# Altium schematic sheet Input - Output.SchDoc
size A4; SheetNumber: 4; SheetTotal: 7
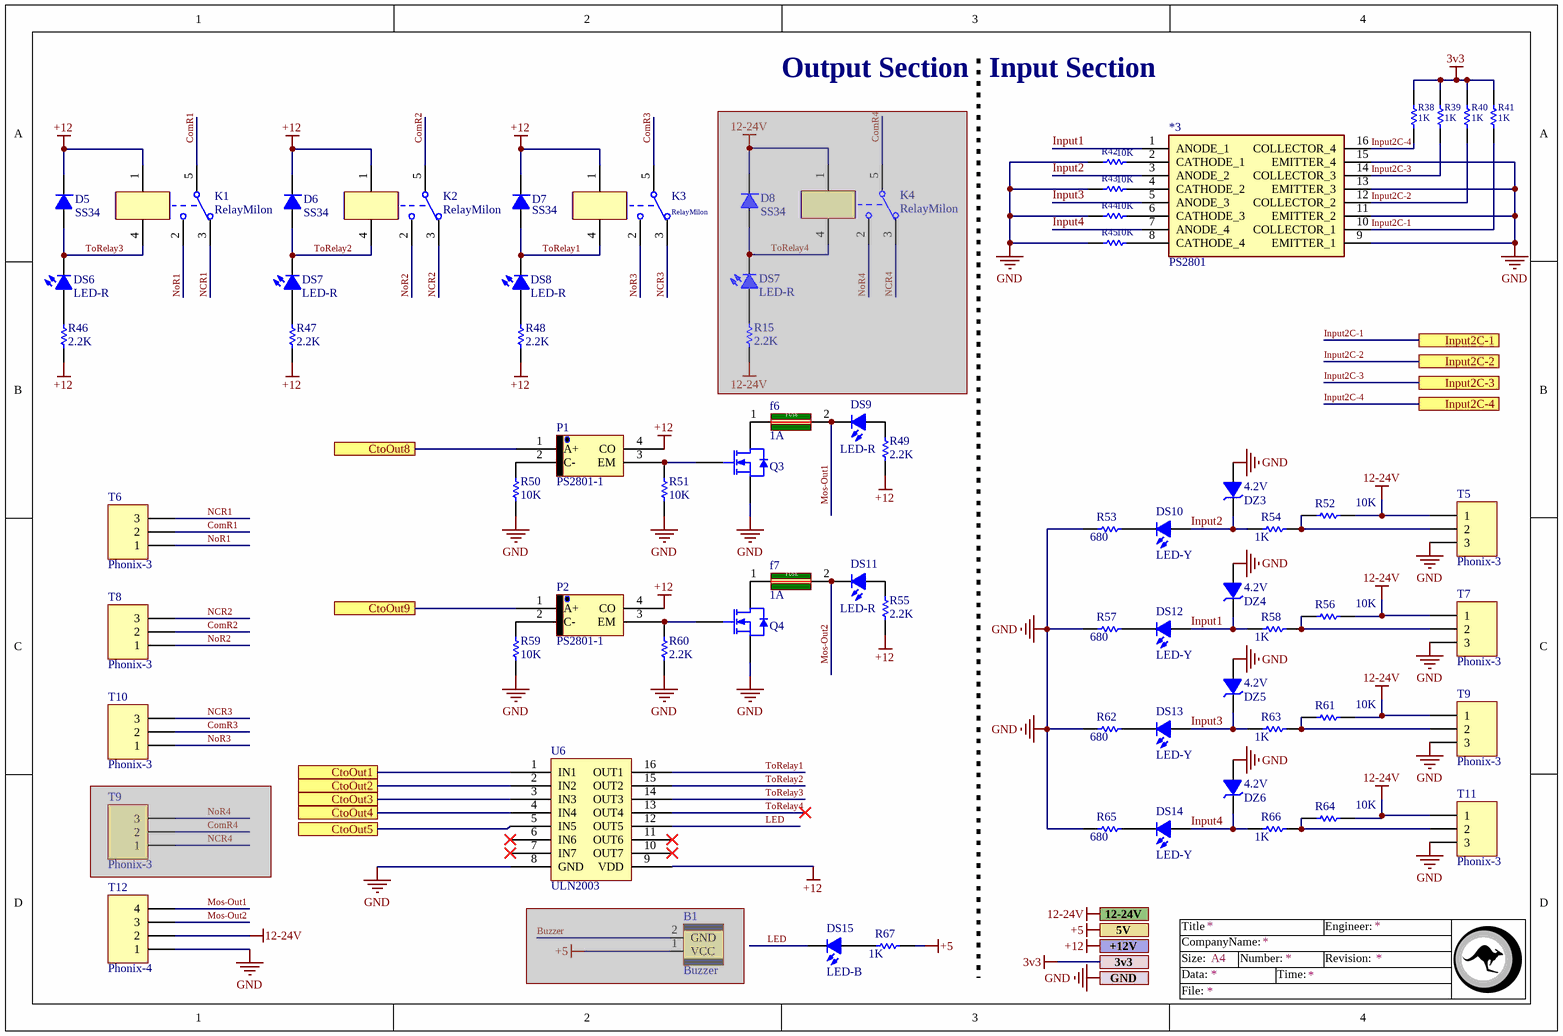
[diagram p0: Input - Output.SchDoc]

## Parts
(Parts that share a designator on the sheet are numbered #1, #2 ... from top to bottom, then left to right.)
*3  PS2801  [PS2801]
B1  Buzzer  [Buzzer]  (masked out: inside a compile mask, not in the netlist)
D5  SS34  [Diod-1A-SMD]
D6  SS34  [Diod-1A-SMD]
D7  SS34  [Diod-1A-SMD]
D8  SS34  [Diod-1A-SMD]  (masked out: inside a compile mask, not in the netlist)
DS6  LED-R  [Led0805]
DS7#1  LED-R  [Led0805]
DS7#2  LED-R  [Led0805]  (masked out: inside a compile mask, not in the netlist)
DS8  LED-R  [Led0805]
DS9  LED-R  [Led0805]
DS10  LED-Y  [Led0805]
DS11  LED-R  [Led0805]
DS12  LED-Y  [Led0805]
DS13  LED-Y  [Led0805]
DS14  LED-Y  [Led0805]
DS15  LED-B  [LED - DipS]
DZ3  4.2V  [LL4148]
DZ4  4.2V  [LL4148]
DZ5  4.2V  [LL4148]
DZ6  4.2V  [LL4148]
f6  1A  [1206]
f7  1A  [1206]
K1  RelayMilon  [Relay_MILONBIG]
K2  RelayMilon  [Relay_MILONBIG]
K3  RelayMilon  [Relay_MILONBIG]
K4  RelayMilon  [Relay_MILONBIG]  (masked out: inside a compile mask, not in the netlist)
P1  PS2801-1  [PS2801-1]
P2  PS2801-1  [PS2801-1]
Q3  MOSFET-N  [TO252-S]  (value not drawn)
Q4  MOSFET-N  [TO252-S]  (value not drawn)
R15  2.2K  [R0805]  (masked out: inside a compile mask, not in the netlist)
R38  1K  [R0805]
R39  1K  [R0805]
R40  1K  [R0805]
R41  1K  [R0805]
R42  10K  [R0805]
R43  10K  [R0805]
R44  10K  [R0805]
R45  10K  [R0805]
R46  2.2K  [R0805]
R47  2.2K  [R0805]
R48  2.2K  [R0805]
R49  2.2K  [R0805]
R50  10K  [R0805]
R51  10K  [R0805]
R52  10K  [R0805]
R53  680  [R0805]
R54  1K  [R0805]
R55  2.2K  [R0805]
R56  10K  [R0805]
R57  680  [R0805]
R58  1K  [R0805]
R59  10K  [R0805]
R60  2.2K  [R0805]
R61  10K  [R0805]
R62  680  [R0805]
R63  1K  [R0805]
R64  10K  [R0805]
R65  680  [R0805]
R66  1K  [R0805]
R67  1K  [R0805]
T5  Phonix-3  [Phonix-3]
T6  Phonix-3  [Phonix-3]
T7  Phonix-3  [Phonix-3]
T8  Phonix-3  [Phonix-3]
T9#1  Phonix-3  [Phonix-3]
T9#2  Phonix-3  [Phonix-3]  (masked out: inside a compile mask, not in the netlist)
T10  Phonix-3  [Phonix-3]
T11  Phonix-3  [Phonix-3]
T12  Phonix-4  [Phonix-4]
U6  ULN2003  [SO16]

## Ports
3v3 (see Dashboard - Multifunctional Probe[1B], Core-ESP32[3D], Ethernet DP[4A], Power Management[3C]), 5V (see Dashboard - Multifunctional Probe[1B], Core-ESP32[3D], Ethernet DP[4A], Power Management[3B]), 12-24V (see Dashboard - Multifunctional Probe[1A], Power Management[1A]), +12V (see Dashboard - Multifunctional Probe[1A], Power Management[3A]), CtoOut1 (see Dashboard - Multifunctional Probe[1B], Core-ESP32[3A]), CtoOut2 (see Dashboard - Multifunctional Probe[1B], Core-ESP32[3B]), CtoOut3 (see Dashboard - Multifunctional Probe[1B], Core-ESP32[3B]), CtoOut4 (see Dashboard - Multifunctional Probe[1B], Core-ESP32[3A]), CtoOut5 (see Dashboard - Multifunctional Probe[1B], Core-ESP32[3B]), CtoOut8 (see Dashboard - Multifunctional Probe[1B], Core-ESP32[3B]), CtoOut9 (see Dashboard - Multifunctional Probe[1B], Core-ESP32[3B]), GND (see Dashboard - Multifunctional Probe[1A], Core-ESP32[3D], Ethernet DP[3D], Power Management[3D], USB2Serial[2D]), Input2C-1 (see Dashboard - Multifunctional Probe[1B], Core-ESP32[1A]), Input2C-2 (see Dashboard - Multifunctional Probe[1B], Core-ESP32[1B]), Input2C-3 (see Dashboard - Multifunctional Probe[1B], Core-ESP32[1B]), Input2C-4 (see Dashboard - Multifunctional Probe[1B], Core-ESP32[1B])

## Nets
3v3: R38.1 R39.1 R40.1 R41.1 ; port 3v3
12-24V: R52.1 R56.1 R61.1 R64.1 T5.1 T7.1 T9#1.1 T11.1 T12.2 ; port 12-24V
+5: R67.1 ; port 5V
+12: D5.K D6.K D7.K K1.1 K2.1 K3.1 P1.4(CO) P2.4(CO) R46.2 R47.2 R48.2 R49.2 R55.2 U6.9(VDD) ; port +12V
GND: *3.9(EMITTER_1) *3.11(EMITTER_2) *3.13(EMITTER_3) *3.15(EMITTER_4) DZ3.A DZ4.A DZ5.A DZ6.A Q3.3 Q4.3 R42.2 R43.2 R44.2 R45.2 R50.2 R51.2 R53.2 R57.2 R59.2 R60.2 R62.2 R65.2 T5.3 T7.3 T9#1.3 T11.3 T12.1 U6.8(GND) ; port GND
ComR1: K1.5 T6.2
ComR2: K2.5 T8.2
ComR3: K3.5 T10.2
CtoOut1: U6.1(IN1) ; port CtoOut1
CtoOut2: U6.2(IN2) ; port CtoOut2
CtoOut3: U6.3(IN3) ; port CtoOut3
CtoOut4: U6.4(IN4) ; port CtoOut4
CtoOut5: U6.5(IN5) ; port CtoOut5
CtoOut8: P1.1(A+) ; port CtoOut8
CtoOut9: P2.1(A+) ; port CtoOut9
Input1: *3.1(ANODE_1) DS12.A DZ4.K R58.2
Input2: *3.3(ANODE_2) DS10.A DZ3.K R54.2
Input2C-1: *3.10(COLLECTOR_1) R41.2 ; port Input2C-1
Input2C-2: *3.12(COLLECTOR_2) R40.2 ; port Input2C-2
Input2C-3: *3.14(COLLECTOR_3) R39.2 ; port Input2C-3
Input2C-4: *3.16(COLLECTOR_4) R38.2 ; port Input2C-4
Input3: *3.5(ANODE_3) DS13.A DZ5.K R63.2
Input4: *3.7(ANODE_4) DS14.A DZ6.K R66.2
LED: DS15.K U6.12(OUT5)
Mos-Out1: DS9.K f6.2(OUT) T12.4
Mos-Out2: DS11.K f7.2(OUT) T12.3
NCR1: K1.3 T6.3
NCR2: K2.3 T8.3
NCR3: K3.3 T10.3
NoR1: K1.2 T6.1
NoR2: K2.2 T8.1
NoR3: K3.2 T10.1
ToRelay1: D7.A DS8.K K3.4 U6.16(OUT1)
ToRelay2: D6.A DS7#1.K K2.4 U6.15(OUT2)
ToRelay3: D5.A DS6.K K1.4 U6.14(OUT3)
ToRelay4: U6.13(OUT4)
Net*3_2: *3.2(CATHODE_1) R42.1
Net*3_4: *3.4(CATHODE_2) R43.1
Net*3_6: *3.6(CATHODE_3) R44.1
Net*3_8: *3.8(CATHODE_4) R45.1
NetDS6_A: DS6.A R46.1
NetDS7#1_A: DS7#1.A R47.1
NetDS8_A: DS8.A R48.1
NetDS9_A: DS9.A R49.1
NetDS10_K: DS10.K R53.1
NetDS11_A: DS11.A R55.1
NetDS12_K: DS12.K R57.1
NetDS13_K: DS13.K R62.1
NetDS14_K: DS14.K R65.1
NetDS15_A: DS15.A R67.2
Netf6_1: f6.1(IN) Q3.4
Netf7_1: f7.1(IN) Q4.4
NetP1_2: P1.2(C-) R50.1
NetP1_3: P1.3(EM) Q3.1 R51.1
NetP2_2: P2.2(C-) R59.1
NetP2_3: P2.3(EM) Q4.1 R60.1
NetR52_2: R52.2 R54.1 T5.2
NetR56_2: R56.2 R58.1 T7.2
NetR61_2: R61.2 R63.1 T9#1.2
NetR64_2: R64.2 R66.1 T11.2

Not connected (* = marked no-connect by the designer): U6 6(IN6)* 7(IN7)* 10(OUT7)* 11(OUT6)*

## Notes on the sheet
- Output Section
- Input Section
- Title
- Size:
- Data:
- CompanyName:
- A4
- Number:
- Time:
- Revision:
- Engineer:
- File:
- (in symbol Fuse) FUSE

## Library data of the parts
D5-D8 = Diode
DS6 DS7#1 DS7#2 DS8-DS15 = LED
DZ3-DZ6 = Diode Zener
f6 f7 = Fuse
Q3 Q4 = MOSFET-N: MOSFET, N-Channel
R15 R38-R67 = Resistor
T5-T8 T9#1 T9#2 T10 T11 = Phonix-3: Connector
T12 = Phonix-4: Connector
U6 = ULN2003: High-voltage, high-current Darlington arrays